# Altium schematic sheet VCA.SchDoc
size Letter; SheetNumber: 10; SheetTotal: 14
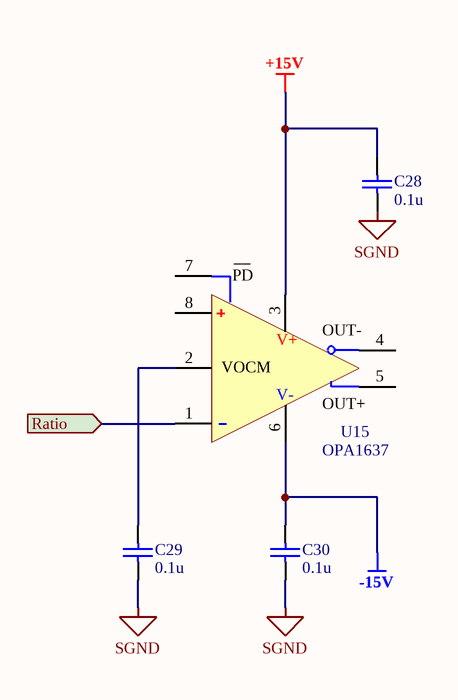
[diagram p0: VCA.SchDoc]

## Parts
C28  value 0.1u  (hidden comment: Capacitor)
C29  value 0.1u  (hidden comment: Capacitor)
C30  value 0.1u  (hidden comment: Capacitor)
U15  OPA1637  [FP-DGK0008A-IPC_A]

## Ports
Ratio (in)

## Nets
+15V: C28.2 U15.3(VS+)
-15V: C30.2 U15.6(VS-)
SGND: C28.1 C29.1 C30.1
Ratio: U15.1(IN-) ; port Ratio
NetC29_2: C29.2 U15.2(VOCM)

Not connected (* = marked no-connect by the designer): U15 4(OUT+) 5(OUT-) 7(~{PD}) 8(IN+)

## Notes on the sheet
- (in symbol OPA1637DGKT) __; PD; V+; V-

## Library data of the parts
C28-C30 = Capacitor: SimulationGenericComponent: True
U15 = OPA1637DGKT: Fully differential amplifier